# Altium schematic sheet Total.SchDoc
size A4
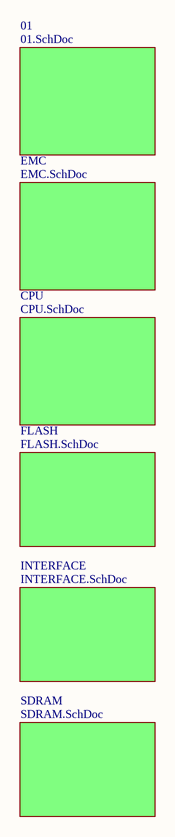
[diagram p0: Total.SchDoc]

## Sub-sheets
01 = 01.SchDoc: no entries
CPU = CPU.SchDoc: no entries
EMC = EMC.SchDoc: no entries
FLASH = FLASH.SchDoc: no entries
INTERFACE = INTERFACE.SchDoc: no entries
SDRAM = SDRAM.SchDoc: no entries